# EAGLE schematic klavesnice (EAGLE 6.5.0)
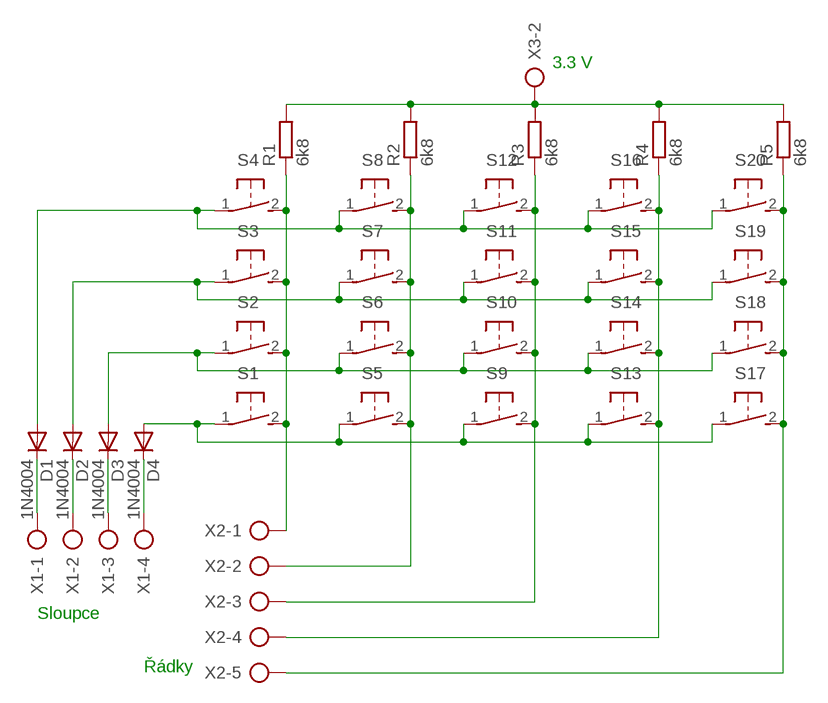
[diagram p0: schematic, sheet 1]

## Parts
D1  1N4004  [DO41-10]
D2  1N4004  [DO41-10]
D3  1N4004  [DO41-10]
D4  1N4004  [DO41-10]
R1  6k8  R-EU_0207/12  [0207/12]
R2  6k8  R-EU_0207/12  [0207/12]
R3  6k8  R-EU_0207/12  [0207/12]
R4  6k8  R-EU_0207/12  [0207/12]
R5  6k8  R-EU_0207/12  [0207/12]
S1  31-XX  [B3F-31XX]
S2  31-XX  [B3F-31XX]
S3  31-XX  [B3F-31XX]
S4  31-XX  [B3F-31XX]
S5  31-XX  [B3F-31XX]
S6  31-XX  [B3F-31XX]
S7  31-XX  [B3F-31XX]
S8  31-XX  [B3F-31XX]
S9  31-XX  [B3F-31XX]
S10  31-XX  [B3F-31XX]
S11  31-XX  [B3F-31XX]
S12  31-XX  [B3F-31XX]
S13  31-XX  [B3F-31XX]
S14  31-XX  [B3F-31XX]
S15  31-XX  [B3F-31XX]
S16  31-XX  [B3F-31XX]
S17  31-XX  [B3F-31XX]
S18  31-XX  [B3F-31XX]
S19  31-XX  [B3F-31XX]
S20  31-XX  [B3F-31XX]
X1  AK500/4-H  [AK500/4-H]
X2  AK500/5-H  [AK500/5-H]
X3  AK500/2-H  [AK500/2-H]

## Nets
N$1: D3.C X1.3
N$2: D2.C X1.2
N$3: D1.C X1.1
N$4: D4.C X1.4
N$5: D4.A S1.1(P) S5.1(P) S9.1(P) S13.1(P) S17.1(P)
N$6: D3.A S2.1(P) S6.1(P) S10.1(P) S14.1(P) S18.1(P)
N$7: D2.A S3.1(P) S7.1(P) S11.1(P) S15.1(P) S19.1(P)
N$8: D1.A S4.1(P) S8.1(P) S12.1(P) S16.1(P) S20.1(P)
N$9: R1.1 S1.2(S) S2.2(S) S3.2(S) S4.2(S) X2.1
N$10: R2.1 S5.2(S) S6.2(S) S7.2(S) S8.2(S) X2.2
N$11: R3.1 S9.2(S) S10.2(S) S11.2(S) S12.2(S) X2.3
N$12: R4.1 S13.2(S) S14.2(S) S15.2(S) S16.2(S) X2.4
N$13: R5.1 S17.2(S) S18.2(S) S19.2(S) S20.2(S) X2.5
N$15: R1.2 R2.2 R3.2 R4.2 R5.2 X3.2
Unconnected: X3.1

## Notes on the sheet
- 3.3 V
- Sloupce
- Řádky

## Library data of the parts
D1-D4 = diode:1N4004: DIODE general purpose rectifier, 1 A
R1-R5 = rcl:R-EU_: RESISTOR, European symbol
S1-S20 = switch-omron:31-XX: OMRON SWITCH; MPN: B3F-3100; OC_FARNELL: 959704; OC_NEWARK: 36M3582
X1 = con-ptr500:AK500/4-H: CONNECTOR Aug. 2004 / PTR Meßtechnik: Die Bezeichnung der Serie AK505 wurde geändert. Es handelt sich hierbei um AK500 in horizontaler Ausführung.; OC_FARNELL: unknown; OC_NEWARK: unknown
X2 = con-ptr500:AK500/5-H: CONNECTOR Aug. 2004 / PTR Meßtechnik: Die Bezeichnung der Serie AK505 wurde geändert. Es handelt sich hierbei um AK500 in horizontaler Ausführung.; OC_FARNELL: unknown; OC_NEWARK: unknown
X3 = con-ptr500:AK500/2-H: CONNECTOR Aug. 2004 / PTR Meßtechnik: Die Bezeichnung der Serie AK505 wurde geändert. Es handelt sich hierbei um AK500 in horizontaler Ausführung.; OC_FARNELL: unknown; OC_NEWARK: unknown